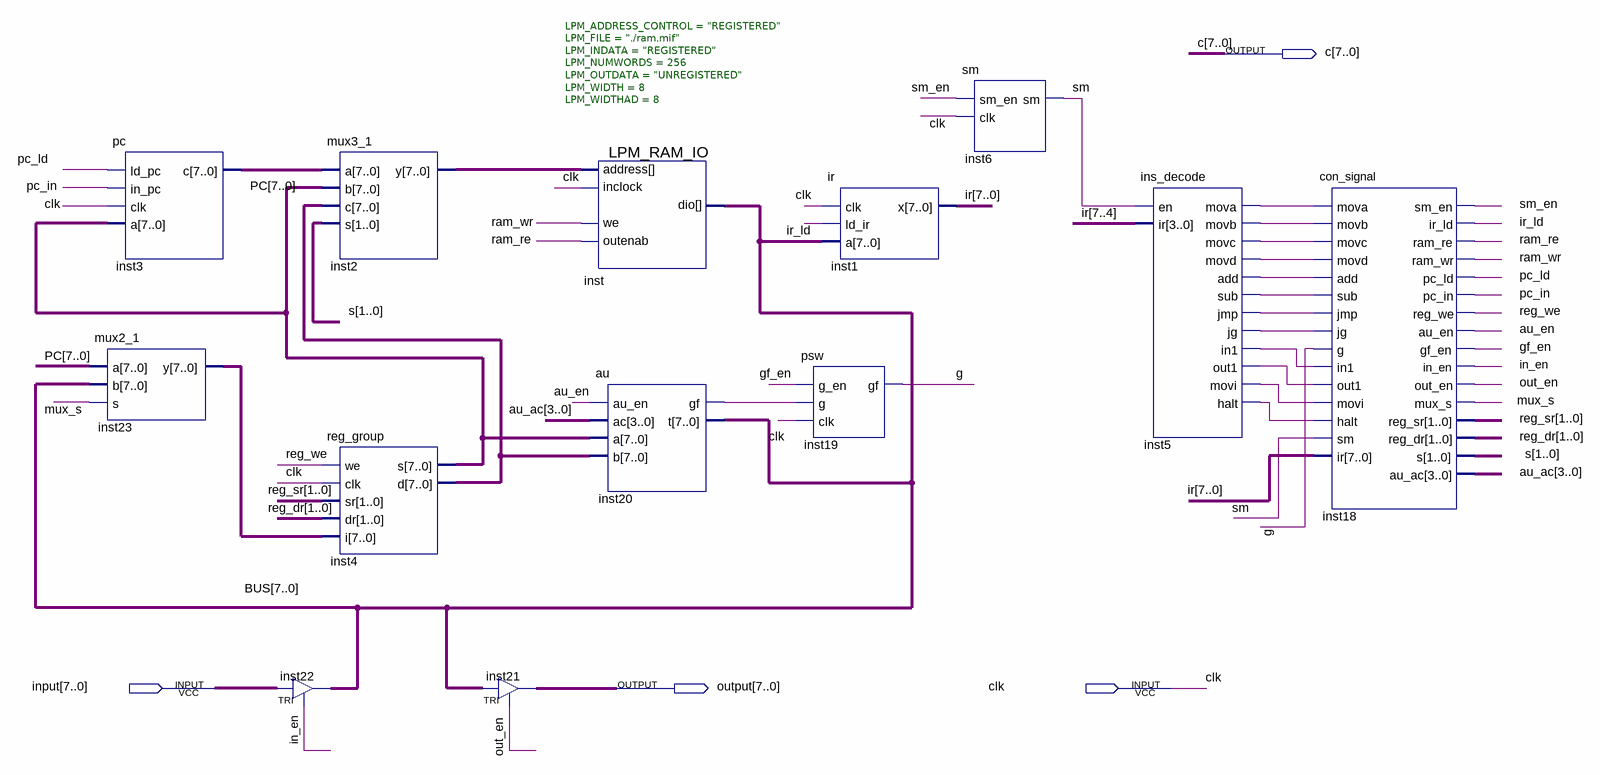
[diagram p0: schematic sheet]
// Quartus schematic small_computer.bdf as structural Verilog: 13 symbols, 4 pins
module small_computer (
  input  [7:0] \input ,
  input  clk,
  output [7:0] c,
  output [7:0] \output 
);

  wire au_en, g, gf_en, in_en, inst5_add, inst5_halt, inst5_in1, inst5_jg, inst5_jmp, inst5_mova, inst5_movb,
       inst5_movc, inst5_movd, inst5_movi, inst5_out1, inst5_sub, inst20_gf, ir_ld, mux_s, out_en, pc_in,
       pc_ld, ram_re, ram_wr, reg_we, sm, sm_en;
  wire [1:0] reg_dr, reg_sr, s;
  wire [3:0] au_ac;
  wire [7:0] BUS, inst2_y, inst4_d, inst4_s, inst23_y, ir, PC;

  mux2_1 inst23 (.a(PC), .b(BUS), .s(mux_s), .y(inst23_y));
  pc inst3 (.ld_pc(pc_ld), .in_pc(pc_in), .clk(clk), .a(inst4_s), .c(PC));
  TRI inst22[7:0] (.IN(\input ), .OE(in_en), .OUT(BUS));
  mux3_1 inst2 (.a(PC), .b(inst4_s), .c(inst4_d), .s(s), .y(inst2_y));
  reg_group inst4 (.we(reg_we), .clk(clk), .sr(reg_sr), .dr(reg_dr), .i(inst23_y), .s(inst4_s), .d(inst4_d));
  TRI inst21[7:0] (.IN(BUS), .OE(out_en), .OUT(\output ));
  LPM_RAM_IO #(.LPM_ADDRESS_CONTROL("REGISTERED"), .LPM_FILE("./ram.mif"), .LPM_INDATA("REGISTERED"), .LPM_NUMWORDS(256), .LPM_OUTDATA("UNREGISTERED"), .LPM_WIDTH(8), .LPM_WIDTHAD(8)) inst (
    .address(inst2_y), .inclock(clk), .we(ram_wr), .outenab(ram_re), .dio(BUS));
  au inst20 (.au_en(au_en), .ac(au_ac), .a(inst4_s), .b(inst4_d), .gf(inst20_gf), .t(BUS));
  psw inst19 (.g_en(gf_en), .g(inst20_gf), .clk(clk), .gf(g));
  ir inst1 (.clk(clk), .ld_ir(ir_ld), .a(BUS), .x(ir));
  sm inst6 (.sm_en(sm_en), .clk(clk), .sm(sm));
  ins_decode inst5 (
    .en(sm), .ir(ir[7:4]), .mova(inst5_mova), .movb(inst5_movb), .movc(inst5_movc), .movd(inst5_movd),
    .add(inst5_add), .sub(inst5_sub), .jmp(inst5_jmp), .jg(inst5_jg), .in1(inst5_in1), .out1(inst5_out1),
    .movi(inst5_movi), .halt(inst5_halt));
  con_signal inst18 (
    .mova(inst5_mova), .movb(inst5_movb), .movc(inst5_movc), .movd(inst5_movd), .add(inst5_add),
    .sub(inst5_sub), .jmp(inst5_jmp), .jg(inst5_jg), .g(g), .in1(inst5_in1), .out1(inst5_out1),
    .movi(inst5_movi), .halt(inst5_halt), .sm(sm), .ir(ir), .sm_en(sm_en), .ir_ld(ir_ld), .ram_re(ram_re),
    .ram_wr(ram_wr), .pc_ld(pc_ld), .pc_in(pc_in), .reg_we(reg_we), .au_en(au_en), .gf_en(gf_en),
    .in_en(in_en), .out_en(out_en), .mux_s(mux_s), .reg_sr(reg_sr), .reg_dr(reg_dr), .s(s), .au_ac(au_ac));
endmodule
